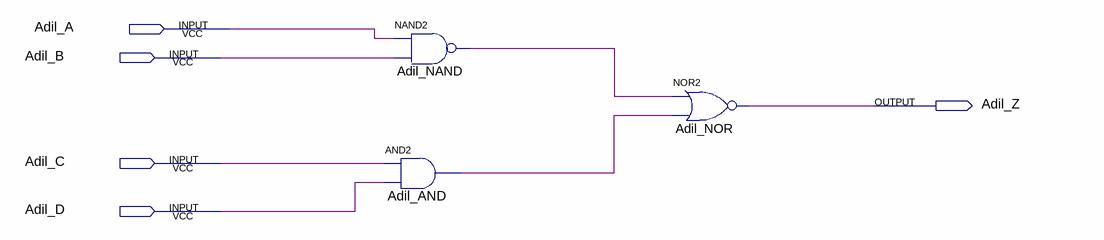
[diagram p0: schematic sheet]
// Quartus schematic Adil_BasicTutorial.bdf as structural Verilog: 3 symbols, 5 pins
module Adil_BasicTutorial (
  input  Adil_A,
  input  Adil_B,
  input  Adil_C,
  input  Adil_D,
  output Adil_Z
);

  wire Adil_AND_out, Adil_NAND_out;

  nand Adil_NAND (Adil_NAND_out, Adil_A, Adil_B);
  and Adil_AND (Adil_AND_out, Adil_C, Adil_D);
  nor Adil_NOR (Adil_Z, Adil_NAND_out, Adil_AND_out);
endmodule
